# Altium schematic sheet Data Logger Shield V2.schdoc
size 300 x 222 mm
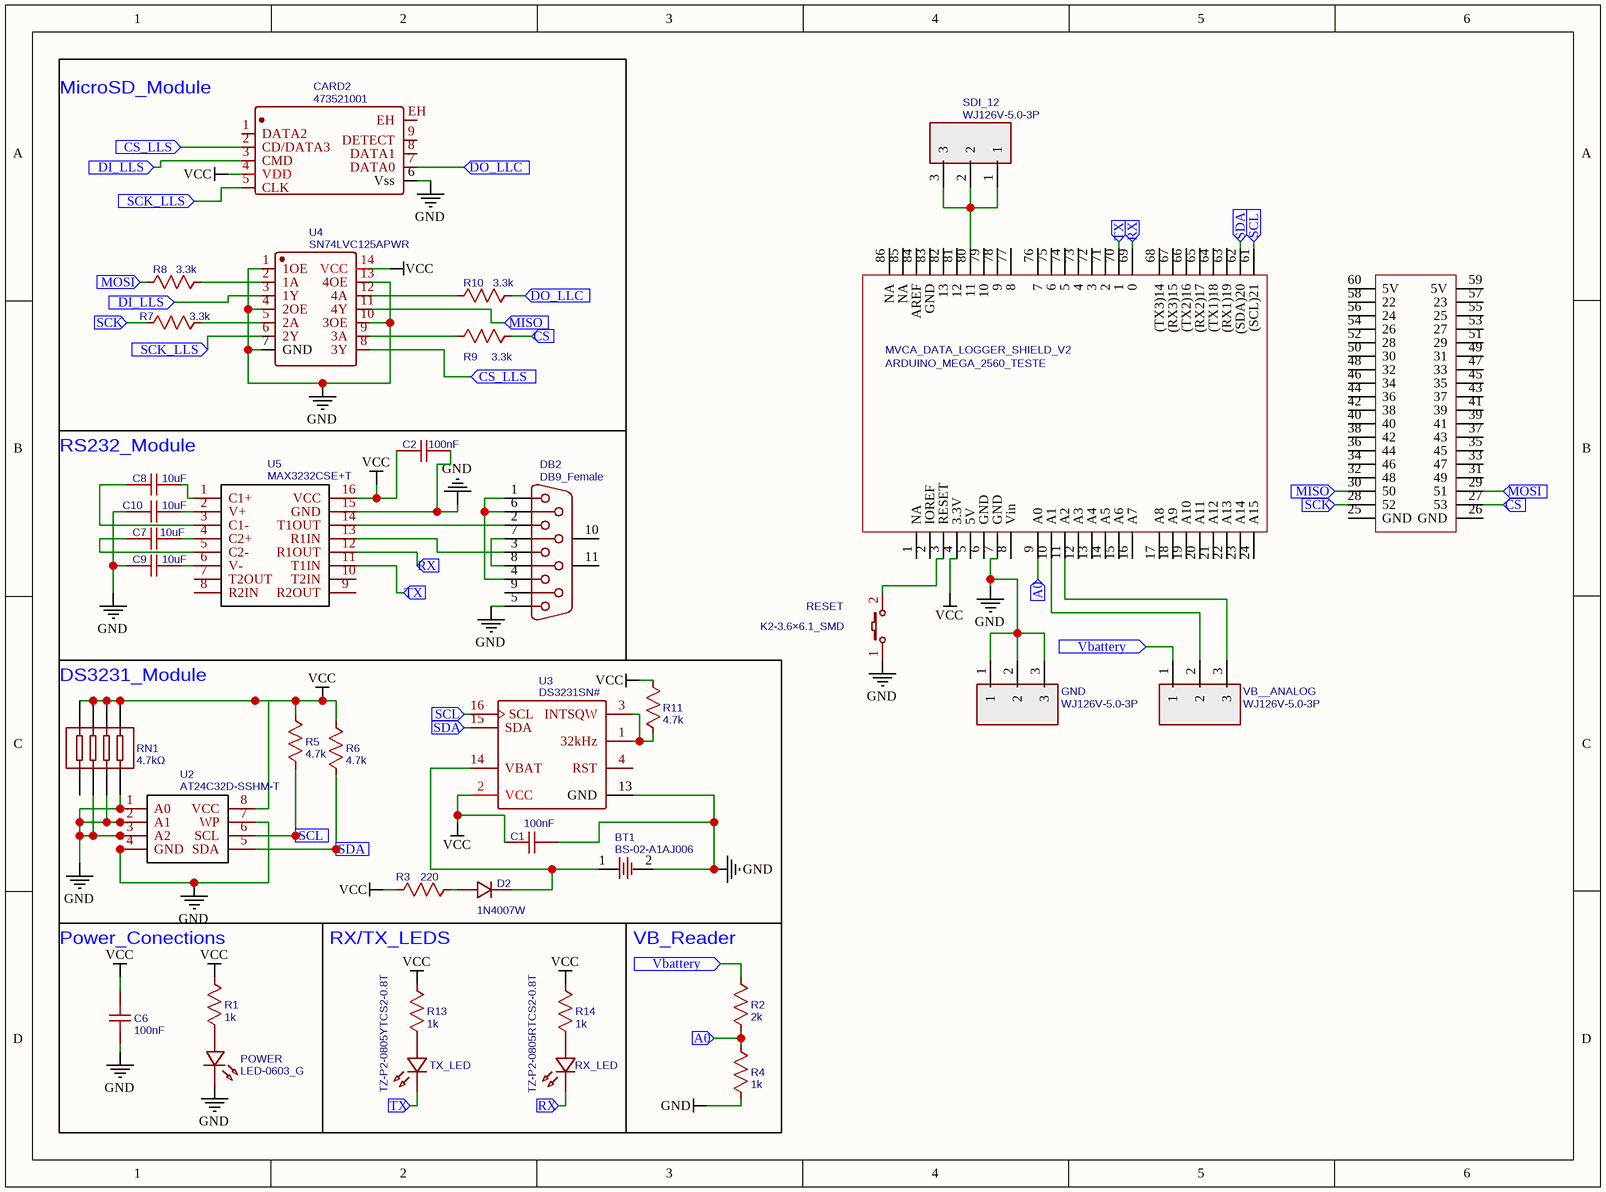
[diagram p0: Data Logger Shield V2.schdoc]

## Parts
BT1  BS-02-A1AJ006  [BAT-TH_MYOUNG_BS-02-A1AJ006]
C1  100nF  [C0603]
C2  100nF  [C0603]
C6  100nF  [C0603]
C7  10uF  [C0603]
C8  10uF  [C0603]
C9  10uF  [C0603]
C10  10uF  [C0603]
CARD2  473521001  [SD-SMD_SD-47352-101]
D2  1N4007W  [SOD-123_L2.8-W1.8-LS3.7-RD]
DB2  DB9_Female  [DSUB-TH_DMR-9S]
GND  WJ126V-5.0-3P  [CONN-TH_3P-P5.00_WJ126V-5.0-3P]
MVCA_DATA_LOGGER_SHIELD_V2  ARDUINO_MEGA_2560_TESTE  [ARDUINOMEGA2560_SHIELD]
POWER  LED-0603_G  [LED0603_GREEN]
R1  1k  [R0603]
R2  2k  [R0603]
R3  220  [R0603]
R4  1k  [R0603]
R5  4.7k  [R0603]
R6  4.7k  [R0603]
R7  3.3k  [R0603]
R8  3.3k  [R0603]
R9  3.3k  [R0603]
R10  3.3k  [R0603]
R11  4.7k  [R0603]
R13  1k  [R0603]
R14  1k  [R0603]
RESET  K2-3.6×6.1_SMD  [KEY-SMD_2P-L6.2-W3.6-LS8.0]
RN1  4.7kΩ  [RES-ARRAY-SMD_8P-L2.0-W1.0-BL-1]
RX_LED  TZ-P2-0805RTCS2-0.8T  [LED0805-RD_RED]
SDI_12  WJ126V-5.0-3P  [CONN-TH_3P-P5.00_WJ126V-5.0-3P]
TX_LED  TZ-P2-0805YTCS2-0.8T  [LED0805-RD_YELLOW]
U2  AT24C32D-SSHM-T  [SOIC-8_L5.0-W4.0-P1.27-LS6.0-BL]
U3  DS3231SN#  [SOIC-16_L10.3-W7.5-P1.27-LS10.3-BL]
U4  SN74LVC125APWR  [TSSOP-14_L5.0-W4.4-P0.65-LS6.4-BL]
U5  MAX3232CSE+T  [SOIC-16_L9.9-W3.9-P1.27-LS6.0-BL]
VB__ANALOG  WJ126V-5.0-3P  [CONN-TH_3P-P5.00_WJ126V-5.0-3P]

## Blocks framed on the sheet
MicroSD_Module: CARD2 R7-R10 U4
RS232_Module: C2 C7-C10 DB2 U5
DS3231_Module: BT1 C1 D2 R3 R5 R6 R11 RN1 U2 U3
Power_Conections: C6 POWER R1
RX/TX_LEDS: R13 R14 RX_LED TX_LED
VB_Reader: R2 R4

## Ports
A0 (in), CS (in), CS_LLS (in), DI_LLS (in), DO_LLC (in), MISO (in), MOSI (in), RX (in), SCK (in), SCK_LLS (in), SCL (in), SDA (in), TX (in), Vbattery (in)

## Nets
GND: BT1.2 C1.1 C2.2 C6.1 C9.1 C10.1 CARD2.6(Vss) DB2.5 GND.1 GND.2 GND.3 MVCA_DATA_LOGGER_SHIELD_V2.7(GND) POWER.2 R4.2 RESET.1 RN1.2 RN1.3 RN1.4 U2.1(A0) U2.2(A1) U2.3(A2) U2.4(GND) U2.7(WP) U3.13(GND) U4.1(1OE) U4.4(2OE) U4.7(GND) U4.10(3OE) U4.13(4OE) U5.15(GND)
VCC: C1.2 C2.1 C6.2 CARD2.4(VDD) MVCA_DATA_LOGGER_SHIELD_V2.4(3.3V) R1.2 R3.2 R5.2 R6.2 R11.2 R13.2 R14.2 RN1.5 RN1.6 RN1.7 RN1.8 U2.8(VCC) U3.2(VCC) U4.14(VCC) U5.16(VCC)
A0: MVCA_DATA_LOGGER_SHIELD_V2.9(A0) R2.2 R4.1 ; port A0
CS: MVCA_DATA_LOGGER_SHIELD_V2.27(53) R9.2 ; port CS
CS_LLS: CARD2.2(CD/DATA3) U4.8(3Y) ; port CS_LLS
DI_LLS: CARD2.3(CMD) U4.3(1Y) ; port DI_LLS
DO_LLC: CARD2.7(DATA0) R10.2 ; port DO_LLC
MISO: MVCA_DATA_LOGGER_SHIELD_V2.30(50) U4.11(4Y) ; port MISO
MOSI: MVCA_DATA_LOGGER_SHIELD_V2.29(51) R8.1 ; port MOSI
RX: MVCA_DATA_LOGGER_SHIELD_V2.69(0) RX_LED.1(K) U5.12(R1OUT) ; port RX
SCK: MVCA_DATA_LOGGER_SHIELD_V2.28(52) R7.1 ; port SCK
SCK_LLS: CARD2.5(CLK) U4.6(2Y) ; port SCK_LLS
SCL: MVCA_DATA_LOGGER_SHIELD_V2.61((SCL)21) R5.1 U2.6(SCL) U3.16(SCL) ; port SCL
SDA: MVCA_DATA_LOGGER_SHIELD_V2.62((SDA)20) R6.1 U2.5(SDA) U3.15(SDA) ; port SDA
TX: MVCA_DATA_LOGGER_SHIELD_V2.70(1) TX_LED.1(K) U5.11(T1IN) ; port TX
Vbattery: R2.1 VB__ANALOG.1 ; port Vbattery
NetBT1_1: BT1.1 D2.1 U3.14(VBAT)
NetC7_1: C7.1 U5.5(C2-)
NetC7_2: C7.2 U5.4(C2+)
NetC8_1: C8.1 U5.3(C1-)
NetC8_2: C8.2 U5.1(C1+)
NetC9_2: C9.2 U5.6(V-)
NetC10_2: C10.2 U5.2(V+)
NetD2_2: D2.2 R3.1
NetDB2_1: DB2.1 DB2.4 DB2.6
NetDB2_2: DB2.2 U5.14(T1OUT)
NetDB2_3: DB2.3 U5.13(R1IN)
NetDB2_7: DB2.7 DB2.8
NetMVCA_DATA_LOGGER_SHIELD_V2_3: MVCA_DATA_LOGGER_SHIELD_V2.3(RESET) RESET.2
NetMVCA_DATA_LOGGER_SHIELD_V2_10: MVCA_DATA_LOGGER_SHIELD_V2.10(A1) VB__ANALOG.2
NetMVCA_DATA_LOGGER_SHIELD_V2_11: MVCA_DATA_LOGGER_SHIELD_V2.11(A2) VB__ANALOG.3
NetMVCA_DATA_LOGGER_SHIELD_V2_80: MVCA_DATA_LOGGER_SHIELD_V2.80(11) SDI_12.1 SDI_12.2 SDI_12.3
NetPOWER_1: POWER.1 R1.1
NetR7_2: R7.2 U4.5(2A)
NetR8_2: R8.2 U4.2(1A)
NetR9_1: R9.1 U4.9(3A)
NetR10_1: R10.1 U4.12(4A)
NetR11_1: R11.1 U3.1(32kHz) U3.3(INTSQW)
NetR13_1: R13.1 TX_LED.2(A)
NetR14_1: R14.1 RX_LED.2(A)

Not connected (* = marked no-connect by the designer): CARD2 1(DATA2) 8(DATA1) 9(DETECT) EH; DB2 9 10(MH1) 11(MH2); MVCA_DATA_LOGGER_SHIELD_V2 1(NA) 2(IOREF) 5(5V) 6(GND) 8(Vin) 12(A3) 13(A4) 14(A5) 15(A6) 16(A7) 17(A8) 18(A9) 19(A10) 20(A11) 21(A12) 22(A13) 23(A14) 24(A15) 25(GND) 26(GND) 31(49) 32(48) 33(47) 34(46) 35(45) 36(44) 37(43) 38(42) 39(41) 40 41(39) 42(38) 43(37) 44(36) 45(35) 46(34) 47(33) 48(32) 49(31) 50(30) 51(29) 52(28) 53(27) 54(26) 55(25) 56(24) 57(23) 58(22) 59(5V) 60(5V) 63((RX1)19) 64((TX1)18) 65((RX2)17) 66((TX2)16) 67((RX3)15) 68((TX3)14) 71(2) 72(3) 73(4) 74(5) 75(6) 76(7) 77(8) 78(9) 79(10) 81(12) 82(13) 83(GND) 84(AREF) 85(NA) 86(NA); RN1 1; U3 4(RST); U5 7(T2OUT) 8(R2IN) 9(R2OUT) 10(T2IN)

## Library data of the parts
BT1 = BS-02-A1AJ006: Manufacturer: MYOUNG(美阳); Contributor: LCSC; Supplier: LCSC; Supplier Part: C964745; Manufacturer Part: BS-02-A1AJ006; JLCPCB Part Class: Extended Part; spicePre: B; spiceSymbolName: BS-02-A1AJ006
C1 C2 C6 = 100nF: nameAlias: Value(F); Contributor: LCEDA_Lib; spicePre: C; spiceSymbolName: C_0603_US
C7-C10 = 10uF: nameAlias: Value(F); Contributor: LCEDA_Lib; spicePre: C; spiceSymbolName: C_0603_US
CARD2 = 473521001: Manufacturer: MOLEX; Contributor: LCSC; Supplier: LCSC; Supplier Part: C293569; Manufacturer Part: 473521001; JLCPCB Part Class: Extended Part; spicePre: C; spiceSymbolName: 473521001
D2 = 1N4007W: Manufacturer: BLUE ROCKET; Contributor: LCEDA_Lib; Supplier: LCSC; Supplier Part: C328592; Manufacturer Part: 1N4007W; spicePre: D; spiceSymbolName: 1N4007W
DB2 = DB9_Female: Manufacturer: Ckmtw(灿科盟); Contributor: LCEDA_Lib; Supplier Part: C141882; Supplier: LCSC; spicePre: D; spiceSymbolName: DB9_Female
GND SDI_12 VB__ANALOG = WJ126V-5.0-3P: Manufacturer: KANGNEX(康奈克斯电气); Supplier: LCSC; Manufacturer Part: WJ126V-5.0-3P; Supplier Part: C8401; JLCPCB Part Class: Extended Part; spicePre: P; spiceSymbolName: WJ126V-5.0-3P
MVCA_DATA_LOGGER_SHIELD_V2 = ARDUINO_MEGA_2560_TESTE: Manufacturer: Teste; Contributor: kaiquesuper20; Supplier: QSCMY12; spicePre: U; spiceSymbolName: ARDUINO_MEGA_2560_TESTE
POWER = LED-0603_G: Manufacturer: EVERLIGHT(台湾亿光); Manufacturer Part: 19-217/GHC-YR1S2/3T; Contributor: LCEDA_Lib; Supplier Part: C72043; Supplier: LCSC; spicePre: L; spiceSymbolName: LED-0603_G
R1 R4 R13 R14 = 1k: nameAlias: Value(Ω); Contributor: LCEDA_Lib; spicePre: R; spiceSymbolName: R_0603_US
R2 = 2k: nameAlias: Value(Ω); Contributor: LCEDA_Lib; spicePre: R; spiceSymbolName: R_0603_US
R3 = 220: nameAlias: Value(Ω); Contributor: LCEDA_Lib; spicePre: R; spiceSymbolName: R_0603_US
R5 R6 R11 = 4.7k: nameAlias: Value(Ω); Contributor: LCEDA_Lib; spicePre: R; spiceSymbolName: R_0603_US
R7-R10 = 3.3k: nameAlias: Value(Ω); Contributor: LCEDA_Lib; spicePre: R; spiceSymbolName: R_0603_US
RESET = K2-3.6×6.1_SMD: Manufacturer Part: K2-1107ST-A4SW-06; Contributor: LCEDA_Lib; 制造商: 韩国韩荣; Supplier Part: C118141; Supplier: LCSC; spicePre: K; spiceSymbolName: K2-3.6×6.1_SMD
RN1 = 4.7kΩ: Manufacturer: Walsin(华新科); Manufacturer Part: WA04X472JTL; Resistance (Ohms): 4.7K; nameAlias: Resistance; Contributor: LCSC; Supplier: LCSC; Supplier Part: C170191; JLCPCB Part Class: Extended Part; spicePre: R; spiceSymbolName: WA04X472JTL
RX_LED = TZ-P2-0805RTCS2-0.8T: Manufacturer: TUOZHAN(拓展光电); Contributor: LCSC; Supplier: LCSC; Supplier Part: C688884; Manufacturer Part: TZ-P2-0805RTCS2-0.8T; JLCPCB Part Class: Extended Part; spicePre: L; spiceSymbolName: TZ-P2-0805RTCS2-0.8T
TX_LED = TZ-P2-0805YTCS2-0.8T: Manufacturer: TUOZHAN(拓展光电); Contributor: LCSC; Supplier: LCSC; Supplier Part: C779458; Manufacturer Part: TZ-P2-0805YTCS2-0.8T; JLCPCB Part Class: Extended Part; spicePre: L; spiceSymbolName: TZ-P2-0805YTCS2-0.8T
U2 = AT24C32D-SSHM-T: Manufacturer: MICROCHIP; Supplier: LCSC; Manufacturer Part: AT24C32D-SSHM-T; Supplier Part: C60583; JLCPCB Part Class: Extended Part; spicePre: U; spiceSymbolName: AT24C32D-SSHM-T
U3 = DS3231SN#: Manufacturer: ADI(亚德诺)/MAXIM(美信); Manufacturer Part: DS3231SN#T&R; subpart_no: 1; tags: Clock; Supplier Part: C9866; Supplier: LCSC; image: http://image.lceda.cn/szlcsc/C9866.jpg; JLCPCB Part Class: Extended Part; spicePre: U; spiceSymbolName: DS3231SN#
U4 = SN74LVC125APWR: Manufacturer: TI(德州仪器); Supplier: LCSC; Manufacturer Part: SN74LVC125APWR; Supplier Part: C7813; JLCPCB Part Class: Extended Part; spicePre: U; spiceSymbolName: SN74LVC125APWR
U5 = MAX3232CSE+T: Manufacturer: ADI(亚德诺)/MAXIM(美信); Supplier: LCSC; Manufacturer Part: MAX3232CSE+T; Supplier Part: C7258; JLCPCB Part Class: Extended Part; spicePre: U; spiceSymbolName: MAX3232CSE+T